# EasyEDA Pro project EasyEDA_proj.epro, schematic Schematic1

## Sheets
1 Power: Board Name: Board1; Create Date: 2025-12-25; Page Name: Power; Project Name: FurModularity 2; Schematic Name: Schematic1; Update Date: 2025-12-27; Company: housey2k.github.io; Page Size: A4; Version: V1.0
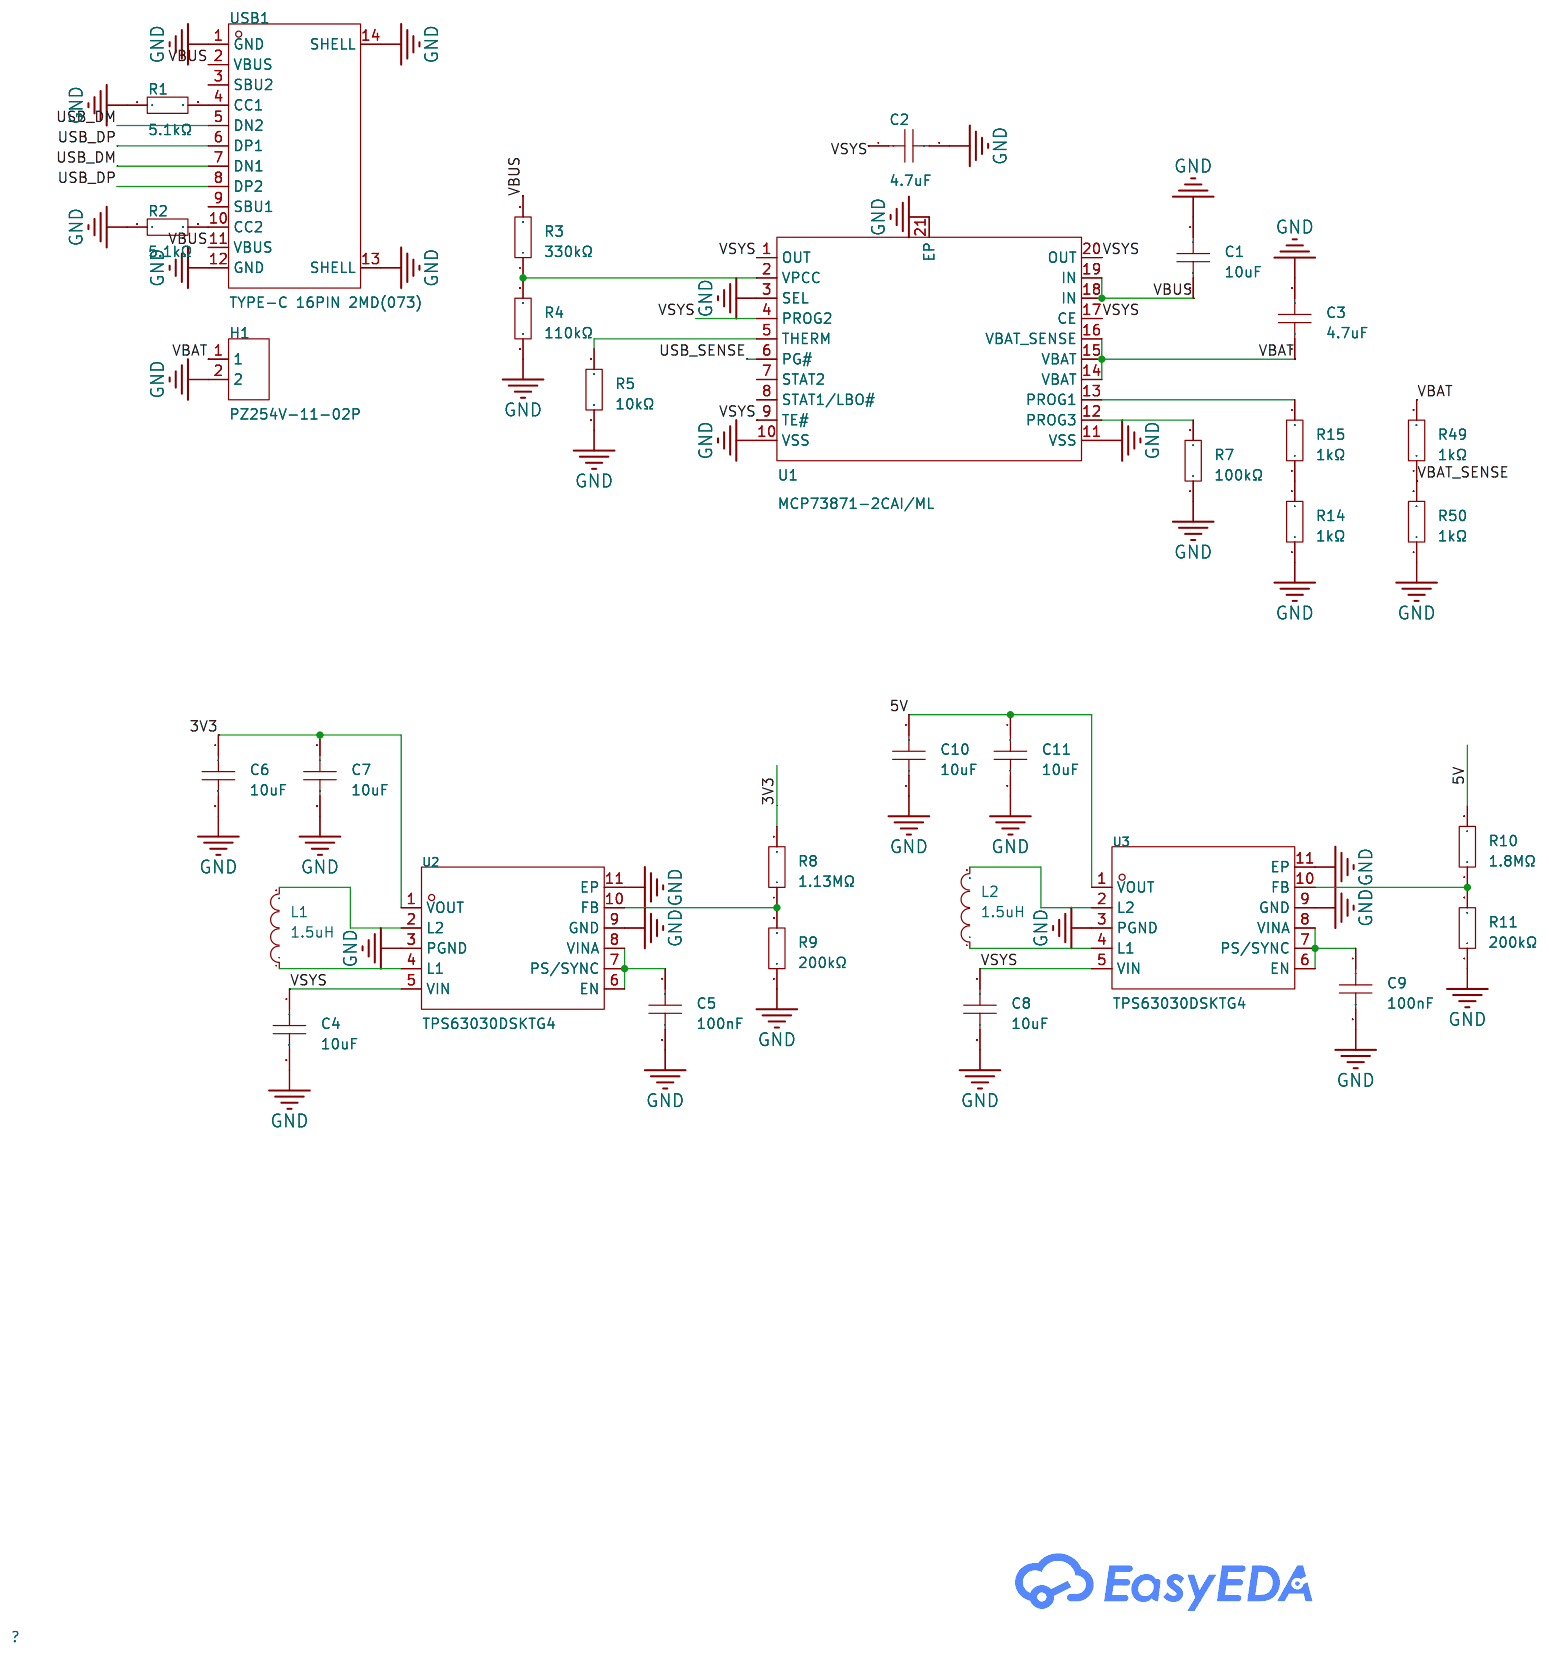
[diagram p0: Power]
2 MCU: Create Date: 2025-12-26; Page Name: MCU; Company: EasyEDA.com
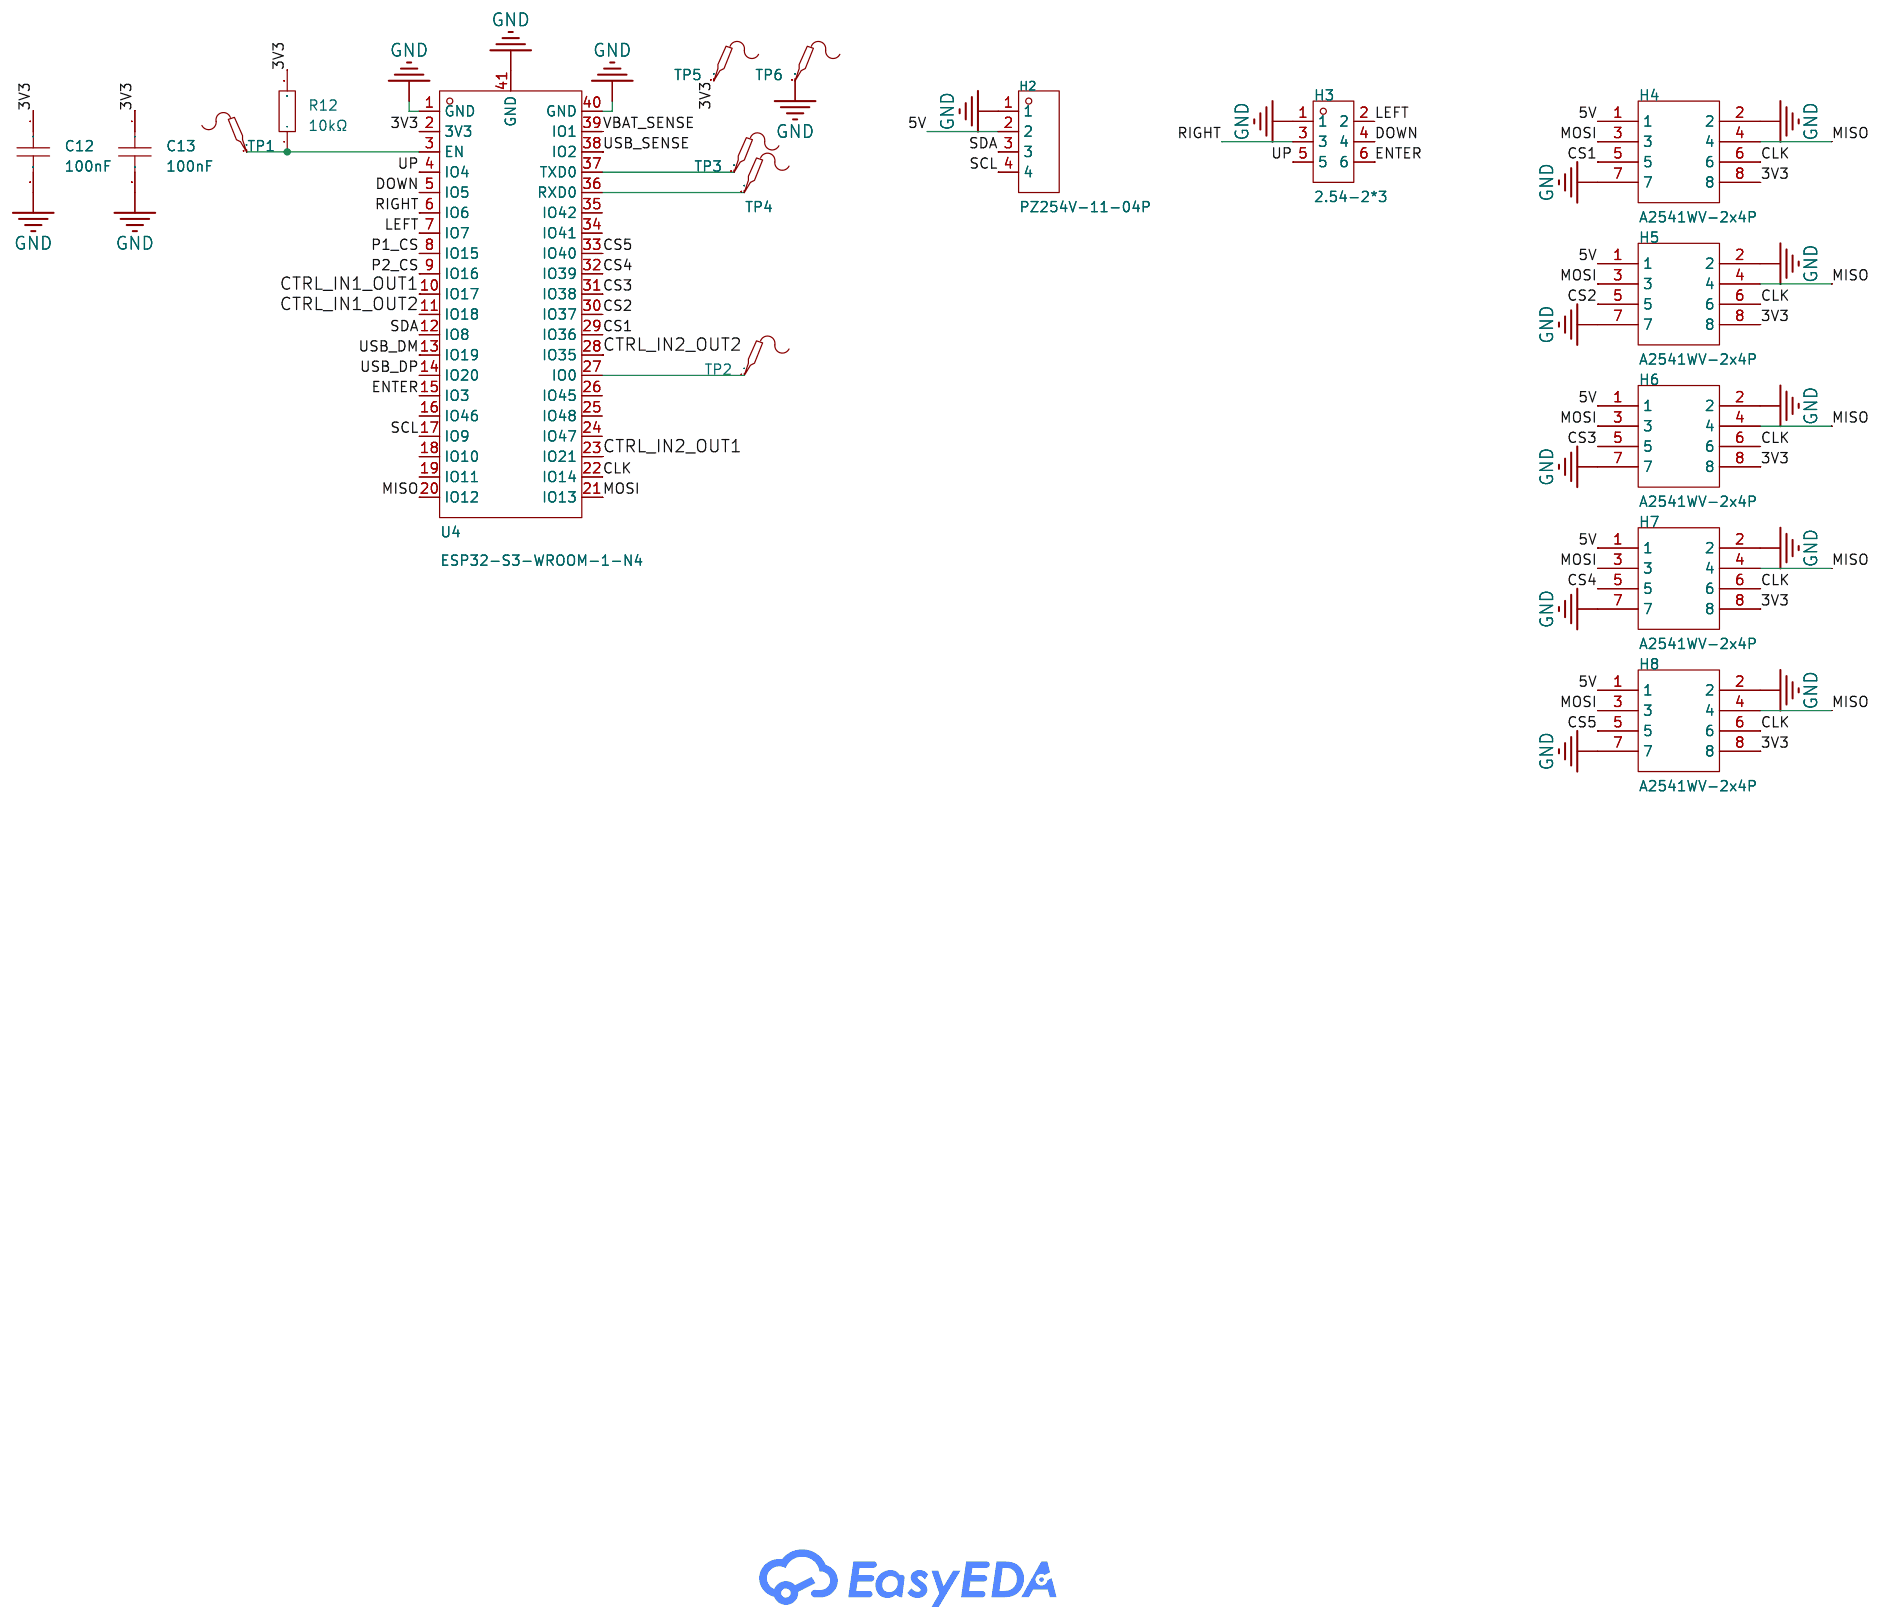
[diagram p1: MCU]
3 Audio: Create Date: 2025-12-26; Page Name: Audio; Company: EasyEDA.com
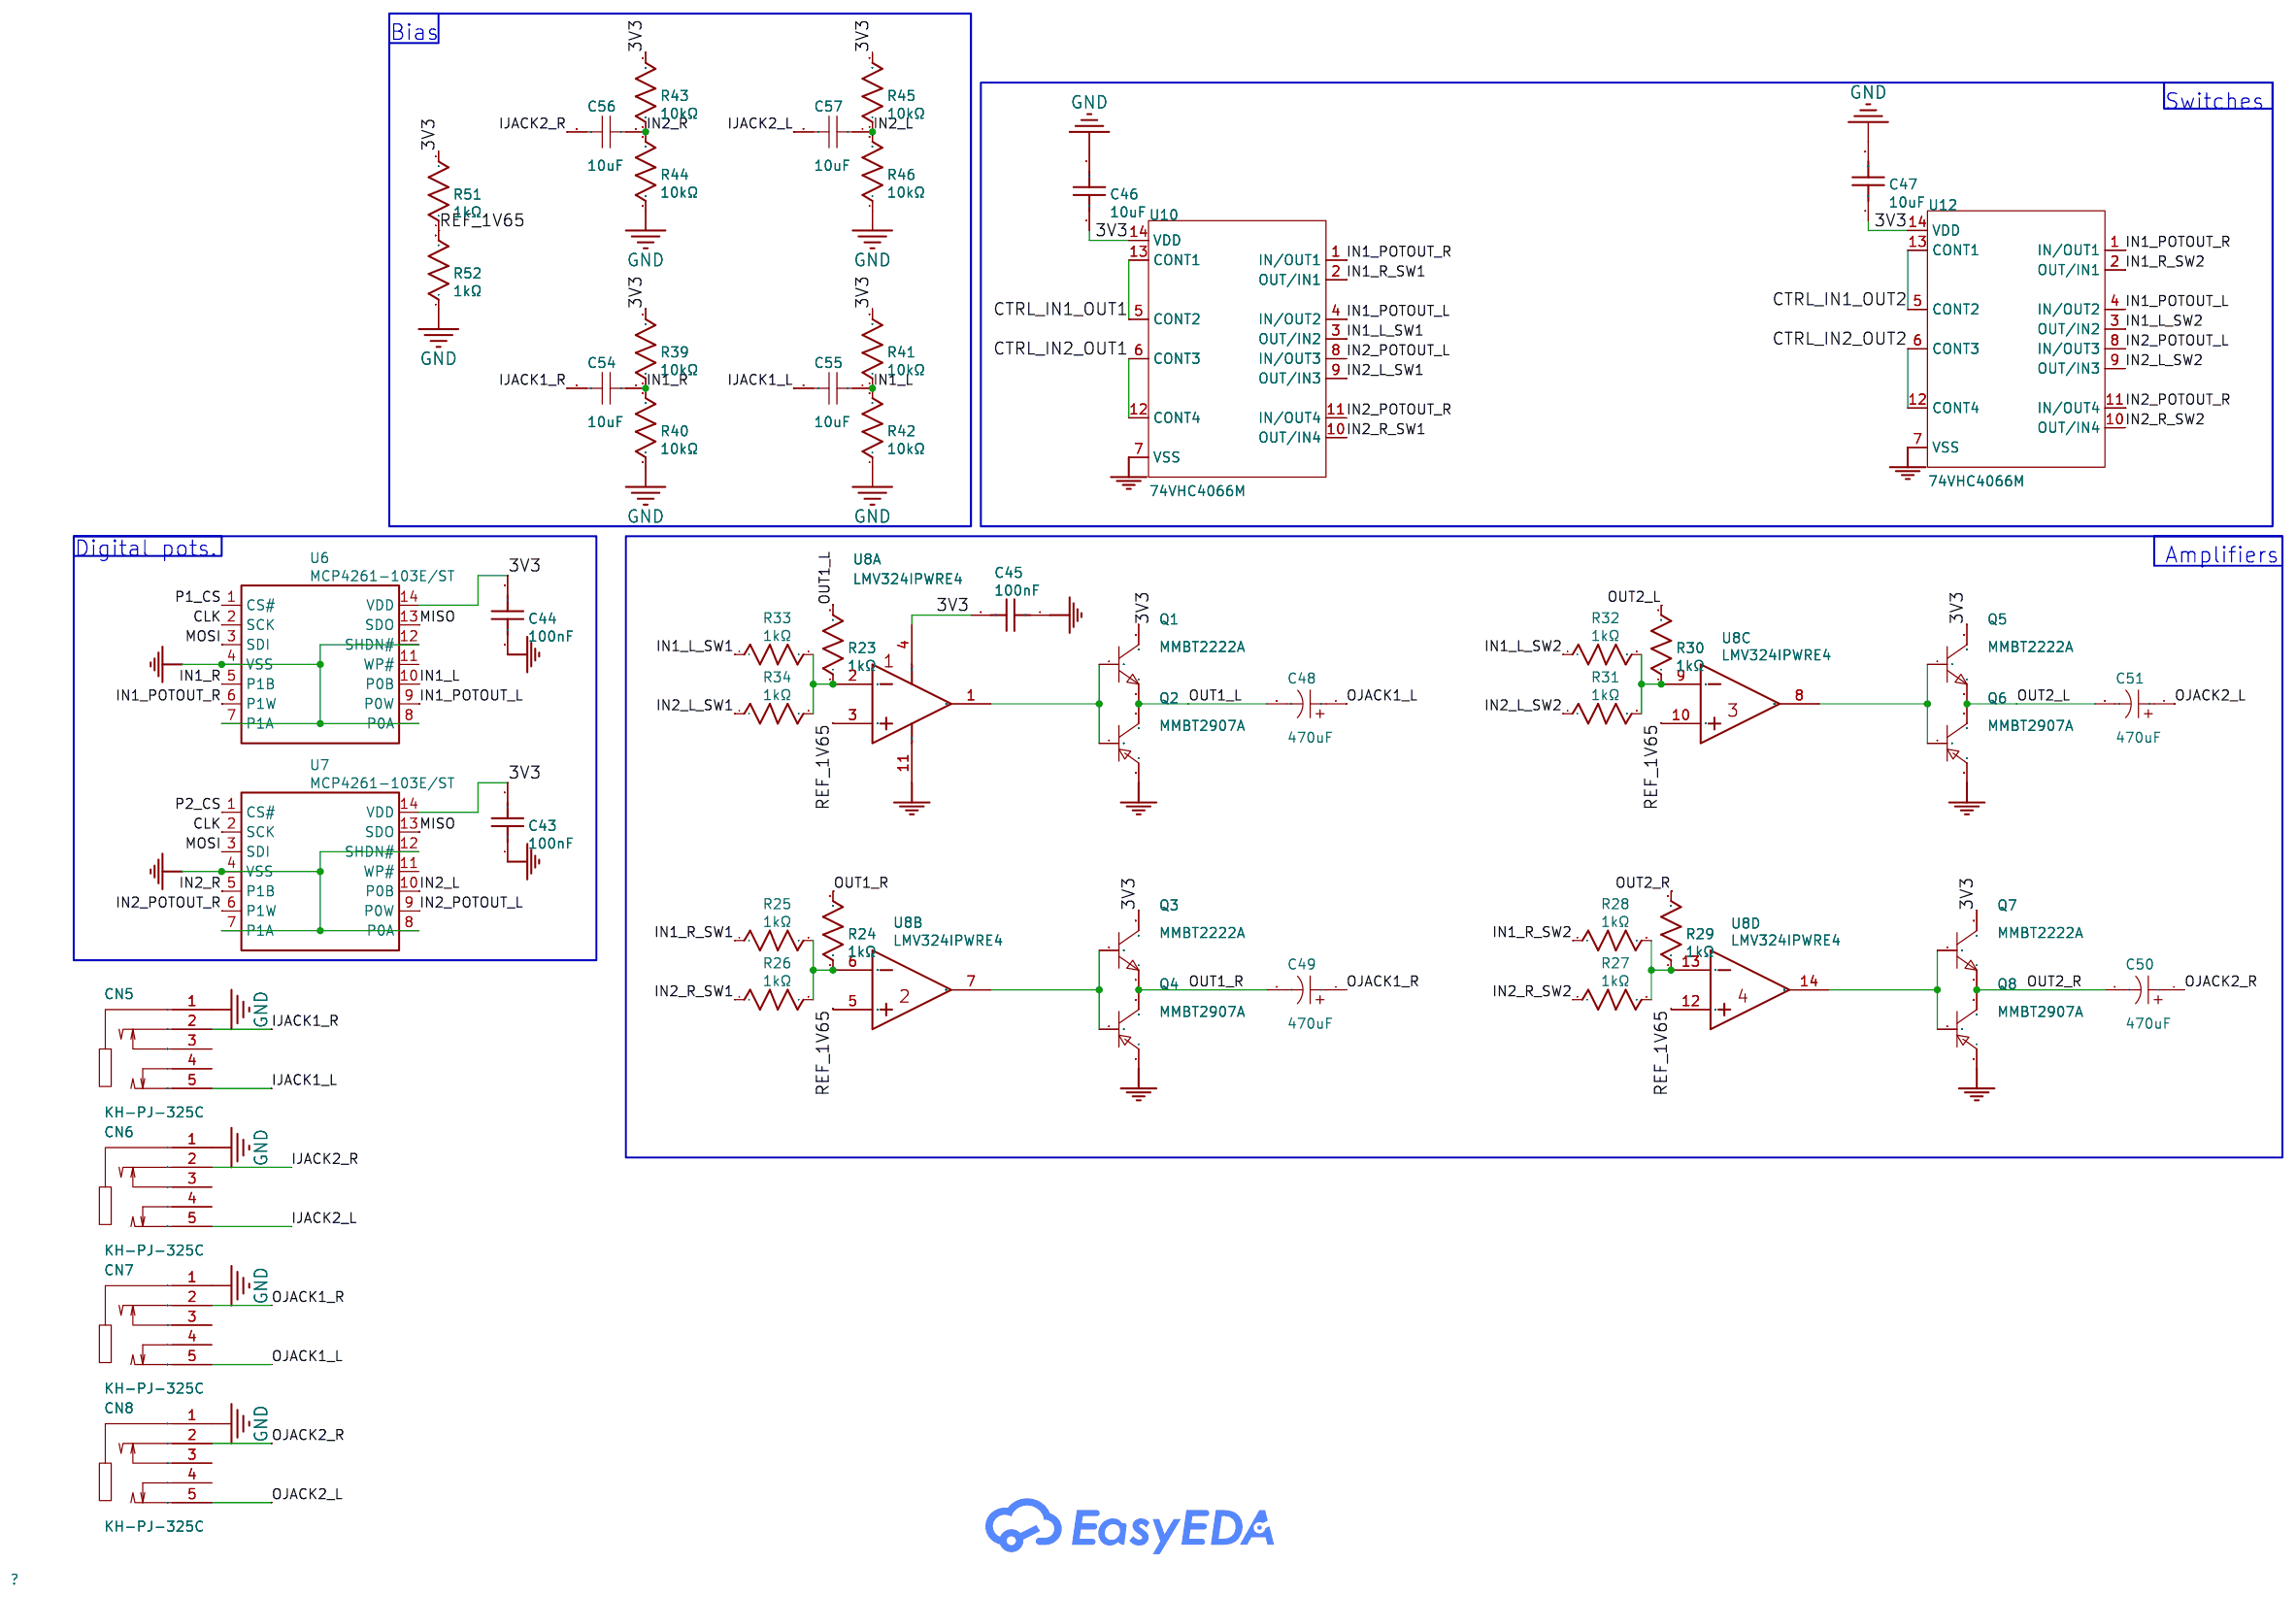
[diagram p2: Audio]

## Parts
sheet Audio
C43  100nF  [C0603]
C44  100nF  [C0603]
C45  100nF  [C0603]
C46  10uF  [C0603]
C47  10uF  [C0603]
C48  470uF  [CAP-SMD_L7.3-W4.3-FD]
C49  470uF  [CAP-SMD_L7.3-W4.3-FD]
C50  470uF  [CAP-SMD_L7.3-W4.3-FD]
C51  470uF  [CAP-SMD_L7.3-W4.3-FD]
C54  10uF  [C0603]
C55  10uF  [C0603]
C56  10uF  [C0603]
C57  10uF  [C0603]
CN5  KH-PJ-325C  [AUDIO-TH_KH-PJ-325C]
CN6  KH-PJ-325C  [AUDIO-TH_KH-PJ-325C]
CN7  KH-PJ-325C  [AUDIO-TH_KH-PJ-325C]
CN8  KH-PJ-325C  [AUDIO-TH_KH-PJ-325C]
Q1  MMBT2222A  [SOT-23-3_L2.9-W1.6-P1.90-LS2.8-BR]
Q2  MMBT2907A  [SOT-23-3_L2.9-W1.3-P1.90-LS2.4-BR]
Q3  MMBT2222A  [SOT-23-3_L2.9-W1.6-P1.90-LS2.8-BR]
Q4  MMBT2907A  [SOT-23-3_L2.9-W1.3-P1.90-LS2.4-BR]
Q5  MMBT2222A  [SOT-23-3_L2.9-W1.6-P1.90-LS2.8-BR]
Q6  MMBT2907A  [SOT-23-3_L2.9-W1.3-P1.90-LS2.4-BR]
Q7  MMBT2222A  [SOT-23-3_L2.9-W1.6-P1.90-LS2.8-BR]
Q8  MMBT2907A  [SOT-23-3_L2.9-W1.3-P1.90-LS2.4-BR]
R23  1kΩ  [R0603]
R24  1kΩ  [R0603]
R25  1kΩ  [R0603]
R26  1kΩ  [R0603]
R27  1kΩ  [R0603]
R28  1kΩ  [R0603]
R29  1kΩ  [R0603]
R30  1kΩ  [R0603]
R31  1kΩ  [R0603]
R32  1kΩ  [R0603]
R33  1kΩ  [R0603]
R34  1kΩ  [R0603]
R39  10kΩ  [R0603]
R40  10kΩ  [R0603]
R41  10kΩ  [R0603]
R42  10kΩ  [R0603]
R43  10kΩ  [R0603]
R44  10kΩ  [R0603]
R45  10kΩ  [R0603]
R46  10kΩ  [R0603]
R51  1kΩ  [R0603]
R52  1kΩ  [R0603]
U6  MCP4261-103E/ST  [TSSOP-14_L5.0-W4.4-P0.65-LS6.4-BL]
U7  MCP4261-103E/ST  [TSSOP-14_L5.0-W4.4-P0.65-LS6.4-BL]
U8  LMV324IPWRE4  [TSSOP-14_L5.0-W4.4-P0.65-LS6.4-BL]  (sections 1,2,3,4)
U10  74VHC4066M  [SOIC-14_L8.7-W3.9-P1.27-LS6.0-BL]
U12  74VHC4066M  [SOIC-14_L8.7-W3.9-P1.27-LS6.0-BL]
sheet MCU
C12  100nF  [C0603]
C13  100nF  [C0603]
H2  PZ254V-11-04P  [HDR-TH_4P-P2.54-V-M]
H3  2.54-2*3  [HDR-TH_6P-P2.54-V-R2-C3-S2.54_A2541WV-2X3P]
H4  A2541WV-2x4P  [HDR-TH_8P-P2.54-V-R2-C4-S2.54_A2541WV-2X4P]
H5  A2541WV-2x4P  [HDR-TH_8P-P2.54-V-R2-C4-S2.54_A2541WV-2X4P]
H6  A2541WV-2x4P  [HDR-TH_8P-P2.54-V-R2-C4-S2.54_A2541WV-2X4P]
H7  A2541WV-2x4P  [HDR-TH_8P-P2.54-V-R2-C4-S2.54_A2541WV-2X4P]
H8  A2541WV-2x4P  [HDR-TH_8P-P2.54-V-R2-C4-S2.54_A2541WV-2X4P]
R12  10kΩ  [R0603]
TP1  -  [Test-Point-0.5mm]
TP2  -  [Test-Point-0.5mm]
TP3  -  [Test-Point-0.5mm]
TP4  -  [Test-Point-0.5mm]
TP5  -  [Test-Point-0.5mm]
TP6  -  [Test-Point-0.5mm]
U4  ESP32-S3-WROOM-1-N4  [WIFIM-SMD_ESP32-S3-WROOM-1-N8]
sheet Power
C1  10uF  [C0603]
C2  4.7uF  [C0603]
C3  4.7uF  [C0603]
C4  10uF  [C0603]
C5  100nF  [C0603]
C6  10uF  [C0603]
C7  10uF  [C0603]
C8  10uF  [C0603]
C9  100nF  [C0603]
C10  10uF  [C0603]
C11  10uF  [C0603]
H1  PZ254V-11-02P  [HDR-TH_2P-P2.54-V-M]
L1  1.5uH  [L1207]
L2  1.5uH  [L1207]
R1  5.1kΩ  [R0603]
R2  5.1kΩ  [R0603]
R3  330kΩ  [R0603]
R4  110kΩ  [R0603]
R5  10kΩ  [R0603]
R7  100kΩ  [R0603]
R8  1.13MΩ  [R0603]
R9  200kΩ  [R0603]
R10  1.8MΩ  [R0603]
R11  200kΩ  [R0603]
R14  1kΩ  [R0603]
R15  1kΩ  [R0603]
R49  1kΩ  [R0603]
R50  1kΩ  [R0603]
U1  MCP73871-2CAI/ML  [QFN-20_L4.0-W4.0-P0.50-BL-EP2.7]
U2  TPS63030DSKTG4  [SON-10_L2.5-W2.5-P0.50-TL-EP]
U3  TPS63030DSKTG4  [SON-10_L2.5-W2.5-P0.50-TL-EP]
USB1  TYPE-C 16PIN 2MD(073)  [USB-C-SMD_TYPE-C-6PIN-2MD-073]

## Library data of the parts
C5 C9 C12 C13 C43-C45 = CC0603KRX7R9BB104: Capacitance:100nF Tolerance:±10% Tolerance:±10% Voltage Rating:50V Temperature Coefficient:X7R; LCSC Part Name: 100nF ±10% 50V; Supplier Part: C14663; Manufacturer: YAGEO(国巨); Supplier Footprint: 0603; JLCPCB Part Class: Basic Part; Datasheet: https://item.szlcsc.com/datasheet/CC0603KRX7R9BB104/15331.html; Supplier: LCSC; Tolerance: ±10%; Voltage Rating: 50V; Temperature Coefficient: X7R
C1 C4 C6-C8 C10 C11 C46 C47 C54-C57 = C0603B106M007T: Capacitance:10uF Tolerance:±20% Tolerance:±20% Voltage Rating:6.3V Temperature Coefficient:X5R; LCSC Part Name: 10uF ±20% 6.3V; Supplier Part: C7094065; Manufacturer: IHHEC(禾伸堂); Supplier Footprint: 0603; JLCPCB Part Class: Extended Part; Datasheet: https://item.szlcsc.com/datasheet/C0603B106M007T/8060709.html; Supplier: LCSC; Tolerance: ±20%; Voltage Rating: 6.3V; Temperature Coefficient: X5R
C48-C51 = CA45-D-6.3V-470UF-K: Capacitance:470uF Tolerance:±10% Tolerance:±10% Voltage Rating:6.3V Current - Leakage:29.6uA Operating Temperature:-55℃~+125℃ Operating Temperature:-55℃~+125℃; LCSC Part Name: 470uF ±10% 6.3V; Supplier Part: C2841148; Manufacturer: CEC(振华新云); JLCPCB Part Class: Extended Part; Datasheet: https://item.szlcsc.com/datasheet/CA45-D-6.3V-470UF-K/3022817.html; Supplier: LCSC; Tolerance: ±10%; Voltage Rating: 6.3V; Current - Leakage: 29.6uA; Operating Temperature: -55℃~+125℃
CN5-CN8 = KH-PJ-325C: Connector Type:3.5mm Headphone Jack Contact Material:Brass；Bronze Contact Plating:Gold；Tin; LCSC Part Name: 3.5mm耳机座; Supplier Part: C5123138; Manufacturer: kinghelm(金航标); JLCPCB Part Class: Extended Part; Datasheet: https://item.szlcsc.com/datasheet/KH-PJ-325C/5715552.html; Supplier: LCSC; Connector Type: 3.5mm Headphone Jack; Contact Material: Brass；Bronze; Contact Plating: Gold；Tin
Q1 Q3 Q5 Q7 = MMBT2222A_C42441802: type:NPN Current - Collector(Ic):600mA Collector - Emitter Voltage VCEO:40V Pd - Power Dissipation:250mW DC Current Gain:300@150mA,10V DC Current Gain:300@150mA,10V Transition frequency(fT):150MHz Current - Collector Cutoff:10nA Vce Saturation(VCE(sat)):1; LCSC Part Name: NPN 电流:0.6A 电压:40V; Supplier Part: C42441802; Manufacturer: TDSEMIC(拓电半导体); Supplier Footprint: SOT-23; Datasheet: https://item.szlcsc.com/datasheet/MMBT2222A/44491127.html; Supplier: LCSC; type: NPN; Current - Collector(Ic): 600mA; Collector - Emitter Voltage VCEO: 40V; Pd - Power Dissipation: 250mW; DC Current Gain: 300@150mA,10V; Transition frequency(fT): 150MHz; Current - Collector Cutoff: 10nA; Vce Saturation(VCE(sat)): 1V@500mA,50mA; Emitter-Base Voltage(Vebo): 6V; Number: 1 NPN
Q2 Q4 Q6 Q8 = MMBT2907A_C7420352: type:- Current - Collector(Ic):600mA Collector - Emitter Voltage VCEO:60V Pd - Power Dissipation:250mW DC Current Gain:100@10mA,10V DC Current Gain:100@10mA,10V Transition frequency(fT):200MHz Current - Collector Cutoff:100nA Vce Saturation(VCE(sat)):400m; LCSC Part Name: 电流:600mA 电压:60V; Supplier Part: C7420352; Manufacturer: R+O(宏嘉诚); Supplier Footprint: SOT-23; JLCPCB Part Class: Extended Part; Datasheet: https://item.szlcsc.com/datasheet/MMBT2907A/8397174.html; Supplier: LCSC; Current - Collector(Ic): 600mA; Collector - Emitter Voltage VCEO: 60V; Pd - Power Dissipation: 250mW; DC Current Gain: 100@10mA,10V; Transition frequency(fT): 200MHz; Current - Collector Cutoff: 100nA; Vce Saturation(VCE(sat)): 400mV; Operating Temperature: -55℃~+150℃; Emitter-Base Voltage(Vebo): 5V
R14 R15 R23-R34 R49-R52 = 0603WAF1001T5E: Type:Thick Film Resistor Resistance:1kΩ Tolerance:±1% Tolerance:±1% Power(Watts):100mW Voltage-Supply(Max):75V Temperature Coefficient:±100ppm/℃ Temperature Coefficient:±100ppm/℃ Operating Temperature:-55℃~+155℃ Operating Temperature:-55℃~+155℃; LCSC Part Name: 1kΩ ±1% 100mW 厚膜电阻; Supplier Part: C21190; Manufacturer: UNI-ROYAL(厚声); Supplier Footprint: 0603; JLCPCB Part Class: Basic Part; Datasheet: https://item.szlcsc.com/datasheet/0603WAF1001T5E/21904.html; Supplier: LCSC; Type: Thick Film Resistor; Tolerance: ±1%; Power(Watts): 100mW; Voltage-Supply(Max): 75V; Temperature Coefficient: ±100ppm/℃; Operating Temperature: -55℃~+155℃
R5 R12 R39-R46 = SCR0603J10K: Type:Thick Film Resistors Resistance: Tolerance:±5% Tolerance:±5% Power(Watts): Overload Voltage (Max): Operating Temperature Range:-55℃~+155℃ Operating Temperature Range:-55℃~+155℃; LCSC Part Name: 厚膜电阻 10kΩ ±5% 100mW; Supplier Part: C3017715; Manufacturer: VO(翔胜); Supplier Footprint: 0603; JLCPCB Part Class: Extended Part; Datasheet: https://atta.szlcsc.com/upload/public/pdf/source/20220513/247AF9639BA21CF93567DC289CCC6A22.pdf; Supplier: LCSC; Type: Thick Film Resistors; Tolerance: ±5%; Operating Temperature Range: -55℃~+155℃
U6 U7 = MCP4261-103E/ST: Supplier: LCSC; Supplier Part: C185580; Manufacturer: MICROCHIP(美国微芯); JLCPCB Part Class: Extended Part; Contributor: LCSC; nameAlias: Value; spicePre: U
U8 = LMV324IPWRE4: Supplier: LCSC; Supplier Part: C4366614; Manufacturer: TI(德州仪器); JLCPCB Part Class: Extended Part; subpart_no: 1; spicePre: U
U10 U12 = 74VHC4066M: Switch Circuit:SPST-NO Number of Channels:4 Voltage - Supply:2V~12V Voltage - Supply:2V~12V Turn-on time:11ns Ron:30Ω Turn-off time:13ns Operating Temperature:-40℃~+85℃ Operating Temperature:-40℃~+85℃ Bandwidth:30MHz Propagation Delay (tpd):30ns; Supplier Part: C3656918; Manufacturer: onsemi(安森美); Supplier Footprint: SOIC-14; JLCPCB Part Class: Extended Part; Datasheet: https://item.szlcsc.com/datasheet/74VHC4066M/4224715.html; Supplier: LCSC; Switch Circuit: SPST-NO; Number of Channels: 4; Voltage - Supply: 2V~12V; Turn-on time: 11ns; Ron: 30Ω; Turn-off time: 13ns; Operating Temperature: -40℃~+85℃; Bandwidth: 30MHz; Propagation Delay (tpd): 30ns
H2 = PZ254V-11-04P: Pin Structure:1x4P Pitch:2.54mm Row Spacing:- Circluar Pins/Square Pins:Pin Header Mounting Type:Through Hole Number of Rows:1 Number of Pins:4P Current Rating:3A Voltage Rating (Max):250V Length of Mating Pin:6mm Insulation Height:2.5mm Length of End Con; LCSC Part Name: 1x4P 间距:2.54mm 方针 直插; Supplier Part: C2691448; Manufacturer: XFCN(兴飞); Supplier Footprint: 插件,P=2.54mm; JLCPCB Part Class: Extended Part; Datasheet: https://item.szlcsc.com/datasheet/PZ254V-11-04P/2801085.html; Supplier: LCSC; Pin Structure: 1x4P; Pitch: 2.54mm; Circluar Pins/Square Pins: Pin Header; Mounting Type: Through Hole; Number of Rows: 1; Number of Pins: 4P; Current Rating: 3A; Voltage Rating (Max): 250V; Length of Mating Pin: 6mm; Insulation Height: 2.5mm; Length of End Connection Pin: 3mm; Operating Temperature: -40℃~+105℃; Color: Black
H3 = 2.54-2*3: Pin Structure:2x3P Pitch:2.54mm Row Spacing:2.54mm Circluar Pins/Square Pins:Pin Header Mounting Type:Through Hole Number of Rows:2 Number of Pins:6P Current Rating:2.5A Length of Mating Pin:6mm Insulation Height:2.54mm Length of End Connection Pin:3mm Co; LCSC Part Name: 2x3P 间距:2.54mm 方针 直插; Supplier Part: C5116479; Manufacturer: ZHOURI(洲日); Supplier Footprint: 插件,P=2.54mm; JLCPCB Part Class: Extended Part; Datasheet: https://item.szlcsc.com/datasheet/2.54-2*3/5692722.html; Supplier: LCSC; Pin Structure: 2x3P; Pitch: 2.54mm; Row Spacing: 2.54mm; Circluar Pins/Square Pins: Pin Header; Mounting Type: Through Hole; Number of Rows: 2; Number of Pins: 6P; Current Rating: 2.5A; Length of Mating Pin: 6mm; Insulation Height: 2.54mm; Length of End Connection Pin: 3mm; Contact Material: Brass; Contact Plating: Gold; Operating Temperature: -40℃~+105℃
H4-H8 = A2541WV-2x4P: Pin Structure:2x4P Pitch:2.54mm Row Spacing:2.54mm Circluar Pins/Square Pins:Policy Mounting Type:Straight Number of Rows:Double Row Number of Pins:8P Current Rating:3A Voltage Rating (Max):250V Length of Mating Pin:6mm Insulation Height:2.54mm Length of; LCSC Part Name: 2x4P 间距:2.54mm 方针 直插; Supplier Part: C225519; Manufacturer: CJT(长江连接器); Supplier Footprint: 插件,P=2.54mm; JLCPCB Part Class: Extended Part; Datasheet: https://atta.szlcsc.com/upload/public/pdf/source/20180724/C239359_48B1BC0CA1B4E4396A63955AAFD15564.pdf; Supplier: LCSC; Pin Structure: 2x4P; Pitch: 2.54mm; Row Spacing: 2.54mm; Circluar Pins/Square Pins: Policy; Mounting Type: Straight; Number of Rows: Double Row; Number of Pins: 8P; Current Rating: 3A; Voltage Rating (Max): 250V; Length of Mating Pin: 6mm; Insulation Height: 2.54mm; Length of End Connection Pin: 3mm; Contact Material: Brass; Contact Plating: Gold; Operating Temperature: -40℃~+105℃; Color: Black
TP1-TP6 = Test-Point: Test Point 测试点; Check: false
U4 = ESP32-S3-WROOM-1-N4: LCSC Part Name: 通用型Wi-Fi+低功耗蓝牙MCU模组; Supplier Part: C2913197; Manufacturer: ESPRESSIF(乐鑫); Supplier Footprint: SMD,25.5x18mm; JLCPCB Part Class: Extended Part; Datasheet: https://item.szlcsc.com/datasheet/ESP32-S3-WROOM-1-N4/3198295.html; Supplier: LCSC
C2 C3 = CL10A475KP8NNNC: Capacitance:4.7uF Tolerance:±10% Tolerance:±10% Voltage Rating:10V Temperature Coefficient:X5R; LCSC Part Name: 4.7uF ±10% 10V; Supplier Part: C1705; Manufacturer: SAMSUNG(三星); Supplier Footprint: 0603; JLCPCB Part Class: Extended Part; Datasheet: https://item.szlcsc.com/datasheet/CL10A475KP8NNNC/2057.html; Supplier: LCSC; Tolerance: ±10%; Voltage Rating: 10V; Temperature Coefficient: X5R
H1 = PZ254V-11-02P: Pin Structure:1x2P Pitch:2.54mm Row Spacing:- Circluar Pins/Square Pins:Pin Header Mounting Type:Through Hole Number of Rows:1 Number of Pins:2P Current Rating:- Voltage Rating (Max):- Length of Mating Pin:6mm Insulation Height:2.5mm Length of End Connect; LCSC Part Name: 1x2P 间距:2.54mm 方针 直插; Supplier Part: C492401; Manufacturer: XFCN(兴飞); Supplier Footprint: 插件,P=2.54mm; JLCPCB Part Class: Extended Part; Datasheet: https://item.szlcsc.com/datasheet/PZ254V-11-02P/502957.html; Supplier: LCSC; Pin Structure: 1x2P; Pitch: 2.54mm; Circluar Pins/Square Pins: Pin Header; Mounting Type: Through Hole; Number of Rows: 1; Number of Pins: 2P; Length of Mating Pin: 6mm; Insulation Height: 2.5mm; Length of End Connection Pin: 3mm; Contact Material: Brass; Operating Temperature: -40℃~+105℃; Color: Black
L1 L2 = LB3218T1R5M: Inductance:1.5uH Tolerance:±20% Tolerance:±20% Current Rating:860mA Current - Saturation (Isat):- DC Resistance(DCR):70mΩ Q @ Frequency:- Frequency - Self Resonant:80MHz Ratings:- Type:Wirewound Chip Inductor; LCSC Part Name: 1.5uH ±20%; Supplier Part: C223380; Manufacturer: TAIYO YUDEN(太诱); Supplier Footprint: 1207; JLCPCB Part Class: Extended Part; Datasheet: https://item.szlcsc.com/datasheet/LB3218T1R5M/223665.html; Supplier: LCSC; Tolerance: ±20%; Current Rating: 860mA; DC Resistance(DCR): 70mΩ; Frequency - Self Resonant: 80MHz; Type: Wirewound Chip Inductor
R1 R2 = HoAR0603-1/10W-5.1KR-0.1%-TCR25: Type:Ceramic resistor Resistance:5.1kΩ Tolerance:±0.1% Tolerance:±0.1% Power(Watts):1/10W Temperature Coefficient:±25ppm/℃ Temperature Coefficient:±25ppm/℃; LCSC Part Name: 陶瓷电阻 5.1kΩ ±0.1% 100mW; Supplier Part: C5123587; Manufacturer: Milliohm(毫欧); Supplier Footprint: 0603; JLCPCB Part Class: Extended Part; Datasheet: https://item.szlcsc.com/datasheet/HoAR0603-1%252F10W-5.1KR-0.1%2525-TCR25/5717802.html; Supplier: LCSC; Type: Ceramic resistor; Tolerance: ±0.1%; Power(Watts): 1/10W; Temperature Coefficient: ±25ppm/℃
R3 = HPCR0603F330KK9: Type:Thick Film Resistors Resistance:330kΩ Tolerance:±1% Tolerance:±1% Power(Watts):- Voltage-Supply(Max):50V Temperature Coefficient:±100ppm/℃ Temperature Coefficient:±100ppm/℃ Operating Temperature:-55℃~+125℃ Operating Temperature:-55℃~+125℃; LCSC Part Name: 厚膜电阻 330kΩ ±1%; Supplier Part: C365145; Manufacturer: RESI(开步睿思); Supplier Footprint: 0603; JLCPCB Part Class: Extended Part; Datasheet: https://item.szlcsc.com/datasheet/HPCR0603F330KK9/339361.html; Supplier: LCSC; Type: Thick Film Resistors; Tolerance: ±1%; Voltage-Supply(Max): 50V; Temperature Coefficient: ±100ppm/℃; Operating Temperature: -55℃~+125℃
R4 = PTFR0603B110KN9: Type:Thin Film Resistor Resistance:110kΩ Tolerance:±0.1% Tolerance:±0.1% Power(Watts):100mW Voltage-Supply(Max):100V Temperature Coefficient:±10ppm/℃ Temperature Coefficient:±10ppm/℃ Operating Temperature:-55℃~+125℃ Operating Temperature:-55℃~+125℃; LCSC Part Name: 薄膜电阻 110kΩ ±0.1% 100mW; Supplier Part: C2692888; Manufacturer: RESI(开步睿思); Supplier Footprint: 0603; JLCPCB Part Class: Extended Part; Datasheet: https://item.szlcsc.com/datasheet/PTFR0603B110KN9/2806377.html; Supplier: LCSC; Type: Thin Film Resistor; Tolerance: ±0.1%; Power(Watts): 100mW; Voltage-Supply(Max): 100V; Temperature Coefficient: ±10ppm/℃; Operating Temperature: -55℃~+125℃
R7 = SCR0603F100K: Type:Thick Film Resistors Resistance: Tolerance:±1% Tolerance:±1% Power(Watts): Overload Voltage (Max): Operating Temperature Range:-55℃~+155℃ Operating Temperature Range:-55℃~+155℃; LCSC Part Name: 厚膜电阻 100kΩ ±1% 100mW; Supplier Part: C3016388; Manufacturer: VO(翔胜); Supplier Footprint: 0603; JLCPCB Part Class: Extended Part; Datasheet: https://atta.szlcsc.com/upload/public/pdf/source/20220513/247AF9639BA21CF93567DC289CCC6A22.pdf; Supplier: LCSC; Type: Thick Film Resistors; Tolerance: ±1%; Operating Temperature Range: -55℃~+155℃
R8 = RTT031134FTP: Type:Thick Film Resistor Resistance:1.13MΩ Tolerance:±1% Tolerance:±1% Power(Watts):100mW Voltage-Supply(Max):75V Temperature Coefficient:±100ppm/℃ Temperature Coefficient:±100ppm/℃ Operating Temperature:-55℃~+155℃ Operating Temperature:-55℃~+155℃; LCSC Part Name: 厚膜电阻 1.13MΩ ±1% 100mW; Supplier Part: C166907; Manufacturer: RALEC(旺诠); Supplier Footprint: 0603; JLCPCB Part Class: Extended Part; Datasheet: https://item.szlcsc.com/datasheet/RTT031134FTP/178290.html; Supplier: LCSC; Type: Thick Film Resistor; Tolerance: ±1%; Power(Watts): 100mW; Voltage-Supply(Max): 75V; Temperature Coefficient: ±100ppm/℃; Operating Temperature: -55℃~+155℃
R9 R11 = SCR0603F200K: Type:Thick Film Resistor Resistance:200kΩ Tolerance:±1% Tolerance:±1% Power(Watts):100mW Voltage-Supply(Max):75V Operating Temperature:-55℃~+155℃ Operating Temperature:-55℃~+155℃; LCSC Part Name: 厚膜电阻 200kΩ ±1% 100mW; Supplier Part: C5140262; Manufacturer: VO(翔胜); Supplier Footprint: 0603; JLCPCB Part Class: Extended Part; Datasheet: https://atta.szlcsc.com/upload/public/pdf/source/20220823/E5DDB4243192CD3C8AE9677163F934FF.pdf; Supplier: LCSC; Type: Thick Film Resistor; Tolerance: ±1%; Power(Watts): 100mW; Voltage-Supply(Max): 75V; Operating Temperature: -55℃~+155℃
R10 = FRC0603J185TS: Type:Thick Film Resistor Resistance:1.8MΩ Tolerance:±5% Tolerance:±5% Power(Watts):100mW Voltage-Supply(Max):75V Temperature Coefficient:±100ppm/℃ Temperature Coefficient:±100ppm/℃ Operating Temperature:-55℃~+155℃ Operating Temperature:-55℃~+155℃; LCSC Part Name: 1.8MΩ ±5% 100mW 厚膜电阻; Supplier Part: C2930026; Manufacturer: FOJAN(富捷); Supplier Footprint: 0603; JLCPCB Part Class: Extended Part; Supplier: LCSC; Type: Thick Film Resistor; Tolerance: ±5%; Power(Watts): 100mW; Voltage-Supply(Max): 75V; Temperature Coefficient: ±100ppm/℃; Operating Temperature: -55℃~+155℃
U1 = MCP73871-2CAI/ML: The Chip Type:Charging IC Voltage - Supply:4.6V~6V Voltage - Supply:4.6V~6V Charge Current - Max:1.8A Charging Saturation Voltage:4.2V Type of Battery:- Number of Cells:1 Number of Cells:1 Operating Temperature:-40℃~+85℃ Operating Temperature:-40℃~+85℃ Ba; LCSC Part Name: 独立系统负载共享及锂离子/锂聚合物电池充电管理控制器; Supplier Part: C185603; Manufacturer: MICROCHIP(美国微芯); Supplier Footprint: QFN-20(4x4); JLCPCB Part Class: Extended Part; Datasheet: https://item.szlcsc.com/datasheet/MCP73871-2CAI%252FML/197008.html; Supplier: LCSC; The Chip Type: Charging IC; Voltage - Supply: 4.6V~6V; Charge Current - Max: 1.8A; Charging Saturation Voltage: 4.2V; Number of Cells: 1; Operating Temperature: -40℃~+85℃; Battery Temperature Detection: Support; 0V Battery Charge: Support; Supply Current (Iq): 28uA
U2 U3 = TPS63030DSKTG4: Function:Buck-boost type Output Type:Adjustable Input Voltage:1.8V~5.5V Input Voltage:1.8V~5.5V Output Voltage:1.2V~5.5V Output Voltage:1.2V~5.5V Output Current (Max):900mA Switching Frequency:2.4MHz Operating Temperature:-40℃~+85℃@(TA) Operating Temperat; Supplier Part: C2072808; Manufacturer: TI(德州仪器); Supplier Footprint: SON-10-EP(2.5x2.5); JLCPCB Part Class: Extended Part; Supplier: LCSC; Function: Buck-boost type; Output Type: Adjustable; Input Voltage: 1.8V~5.5V; Output Voltage: 1.2V~5.5V; Output Current (Max): 900mA; Switching Frequency: 2.4MHz; Operating Temperature: -40℃~+85℃@(TA); Synchronous Rectification: Yes; Number of Outputs: 1; Topology: Step-down-Boost; Switch tube (built-in/external): 内置
USB1 = TYPE-C 16PIN 2MD(073): Connector Type:Type-C Protocol Standard:- Gender:Female Mounting Type:Surface Mount, Right Angle Number of Contacts:16P Number of Ports:1 Current Rating-Power:3A Voltage Rating:5V Connect-Disconnect Life:5,000 Cycles Supplementary Features:- Center Height; LCSC Part Name: Type-C 母 卧贴; Supplier Part: C2765186; Manufacturer: SHOU HAN(首韩); Supplier Footprint: SMD; JLCPCB Part Class: Extended Part; Datasheet: https://item.szlcsc.com/datasheet/TYPE-C%252016PIN%25202MD(073)/2901843.html; Supplier: LCSC; Connector Type: Type-C; Gender: Female; Mounting Type: Surface Mount, Right Angle; Number of Contacts: 16P; Number of Ports: 1; Current Rating-Power: 3A; Voltage Rating: 5V; Connect-Disconnect Life: 5,000 Cycles; Detection color: Black; Operating Temperature: -25℃~+85℃

## Nets
3V3: C6.1 C7.1 C12.1 C13.1 C43.2 C44.2 C45.2 C46.1 C47.1 H4.8 H5.8 H6.8 H7.8 H8.8 Q1.3(C) Q3.3(C) Q5.3(C) Q7.3(C) R8.2 R12.2 R39.2 R41.2 R43.2 R45.2 R51.2 TP5.1 U2.1(VOUT) U4.2(3V3) U6.14(VDD) U7.14(VDD) U8.4(VCC+) U10.14(VDD) U12.14(VDD)
5V: C10.1 C11.1 H2.2 H4.1 H5.1 H6.1 H7.1 H8.1 R10.2 U3.1(VOUT)
GND: C1.1 C2.2 C3.2 C4.2 C5.2 C6.2 C7.2 C8.2 C9.2 C10.2 C11.2 C12.2 C13.2 C43.1 C44.1 C45.1 C46.2 C47.2 CN5.1 CN6.1 CN7.1 CN8.1 H1.2 H2.1 H3.1 H4.2 H4.7 H5.2 H5.7 H6.2 H6.7 H7.2 H7.7 H8.2 H8.7 Q2.2(E) Q4.2(E) Q6.2(E) Q8.2(E) R1.1 R2.1 R4.1 R5.1 R7.1 R9.1 R11.1 R14.1 R40.1 R42.1 R44.1 R46.1 R50.1 R52.1 TP6.1 U1.3(SEL) U1.10(VSS) U1.11(VSS) U1.21(EP) U2.3(PGND) U2.9(GND) U2.11(EP) U3.3(PGND) U3.9(GND) U3.11(EP) U4.1(GND) U4.40(GND) U4.41(GND) U6.4(VSS) U6.7(P1A) U6.8(P0A) U6.12(SHDN#) U7.4(VSS) U7.7(P1A) U7.8(P0A) U7.12(SHDN#) U8.11(GND) U10.7(VSS) U12.7(VSS) USB1.1(GND) USB1.12(GND) USB1.13(SHELL) USB1.14(SHELL)
VBAT: C3.1 H1.1 R49.2 U1.14(VBAT) U1.15(VBAT) U1.16(VBAT_SENSE)
VBAT_SENSE: R49.1 R50.2 U4.39(IO1)
VBUS: C1.2 R3.2 U1.18(IN) U1.19(IN) USB1.2(VBUS) USB1.11(VBUS)
CLK: H4.6 H5.6 H6.6 H7.6 H8.6 U4.22(IO14) U6.2(SCK) U7.2(SCK)
CS1: H4.5 U4.29(IO36)
CS2: H5.5 U4.30(IO37)
CS3: H6.5 U4.31(IO38)
CS4: H7.5 U4.32(IO39)
CS5: H8.5 U4.33(IO40)
CTRL_IN1_OUT1: U4.10(IO17) U10.5(CONT2) U10.13(CONT1)
CTRL_IN1_OUT2: U4.11(IO18) U12.5(CONT2) U12.13(CONT1)
CTRL_IN2_OUT1: U4.23(IO21) U10.6(CONT3) U10.12(CONT4)
CTRL_IN2_OUT2: U4.28(IO35) U12.6(CONT3) U12.12(CONT4)
DOWN: H3.4 U4.5(IO5)
ENTER: H3.6 U4.15(IO3)
IJACK1_L: C55.2 CN5.5
IJACK1_R: C54.2 CN5.2
IJACK2_L: C57.2 CN6.5
IJACK2_R: C56.2 CN6.2
IN1_L: C55.1 R41.1 R42.2 U6.10(P0B)
IN1_L_SW1: R33.1 U10.3(OUT/IN2)
IN1_L_SW2: R32.1 U12.3(OUT/IN2)
IN1_POTOUT_L: U6.9(P0W) U10.4(IN/OUT2) U12.4(IN/OUT2)
IN1_POTOUT_R: U6.6(P1W) U10.1(IN/OUT1) U12.1(IN/OUT1)
IN1_R: C54.1 R39.1 R40.2 U6.5(P1B)
IN1_R_SW1: R25.1 U10.2(OUT/IN1)
IN1_R_SW2: R28.1 U12.2(OUT/IN1)
IN2_L: C57.1 R45.1 R46.2 U7.10(P0B)
IN2_L_SW1: R34.1 U10.9(OUT/IN3)
IN2_L_SW2: R31.1 U12.9(OUT/IN3)
IN2_POTOUT_L: U7.9(P0W) U10.8(IN/OUT3) U12.8(IN/OUT3)
IN2_POTOUT_R: U7.6(P1W) U10.11(IN/OUT4) U12.11(IN/OUT4)
IN2_R: C56.1 R43.1 R44.2 U7.5(P1B)
IN2_R_SW1: R26.1 U10.10(OUT/IN4)
IN2_R_SW2: R27.1 U12.10(OUT/IN4)
LEFT: H3.2 U4.7(IO7)
MISO: H4.4 H5.4 H6.4 H7.4 H8.4 U4.20(IO12) U6.13(SDO) U7.13(SDO)
MOSI: H4.3 H5.3 H6.3 H7.3 H8.3 U4.21(IO13) U6.3(SDI) U7.3(SDI)
OJACK1_L: C48.1 CN7.5
OJACK1_R: C49.1 CN7.2
OJACK2_L: C51.1 CN8.5
OJACK2_R: C50.1 CN8.2
OUT1_L: C48.2 Q1.2(E) Q2.3(C) R23.2
OUT1_R: C49.2 Q3.2(E) Q4.3(C) R24.2
OUT2_L: C51.2 Q5.2(E) Q6.3(C) R30.2
OUT2_R: C50.2 Q7.2(E) Q8.3(C) R29.2
P1_CS: U4.8(IO15) U6.1(CS#)
P2_CS: U4.9(IO16) U7.1(CS#)
REF_1V65: R51.1 R52.2 U8.3(1IN+) U8.5(2IN+) U8.10(3IN+) U8.12(4IN+)
RIGHT: H3.3 U4.6(IO6)
SCL: H2.4 U4.17(IO9)
SDA: H2.3 U4.12(IO8)
UP: H3.5 U4.4(IO4)
USB_DM: U4.13(IO19) USB1.5(DN2) USB1.7(DN1)
USB_DP: U4.14(IO20) USB1.6(DP1) USB1.8(DP2)
USB_SENSE: U1.6(PG#) U4.38(IO2)
VSYS: C2.1 C4.1 C8.1 U1.1(OUT) U1.4(PROG2) U1.9(TE#) U1.17(CE) U1.20(OUT) U2.5(VIN) U3.5(VIN)
$1N480: R1.2 USB1.4(CC1)
$1N506: R2.2 USB1.10(CC2)
$1N1632: R3.1 R4.2 U1.2(VPCC)
$1N1764: R5.2 U1.5(THERM)
$1N1839: R15.2 U1.13(PROG1)
$1N1881: R7.2 U1.12(PROG3)
$1N2370: C5.1 U2.6(EN) U2.7(PS/SYNC) U2.8(VINA)
$1N2432: L1.2 U2.2(L2)
$1N2438: L1.1 U2.4(L1)
$1N2461: R8.1 R9.2 U2.10(FB)
$1N3033: R10.1 R11.2 U3.10(FB)
$1N3038: L2.2 U3.2(L2)
$1N3051: C9.1 U3.6(EN) U3.7(PS/SYNC) U3.8(VINA)
$1N3063: L2.1 U3.4(L1)
$1N4175: R14.2 R15.1
$2N491: TP2.1 U4.27(IO0)
$2N495: R12.1 TP1.1 U4.3(EN)
$2N518: TP3.1 U4.37(TXD0)
$2N539: TP4.1 U4.36(RXD0)
$3N1138: R23.1 R33.2 R34.2 U8.2(1IN-)
$3N1139: R24.1 R25.2 R26.2 U8.6(2IN-)
$3N1144: R27.2 R28.2 R29.1 U8.13(4IN-)
$3N1145: R30.1 R31.2 R32.2 U8.9(3IN-)
$3N1256: Q5.1(B) Q6.1(B) U8.8(3OUT)
$3N2308: Q1.1(B) Q2.1(B) U8.1(OUT)
$3N2351: Q3.1(B) Q4.1(B) U8.7(2OUT)
$3N2603: Q7.1(B) Q8.1(B) U8.14(4OUT)

Not connected (* = marked no-connect by the designer): CN5 3 4; CN6 3 4; CN7 3 4; CN8 3 4; U1 7(STAT2) 8(STAT1/LBO#); U4 16(IO46) 18(IO10) 19(IO11) 24(IO47) 25(IO48) 26(IO45) 34(IO41) 35(IO42); U6 11(WP#); U7 11(WP#); USB1 3(SBU2) 9(SBU1)

## Notes on the sheets
sheet 3
- Bias
- Switches
- Digital pots.
- Amplifiers
